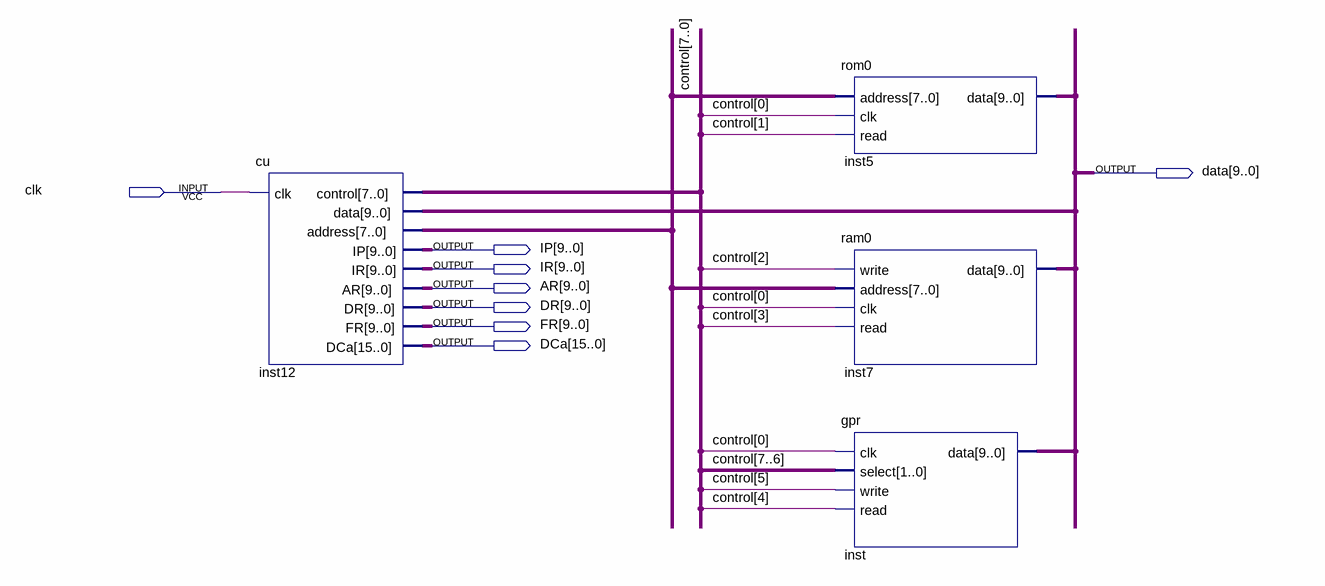
[diagram p0: schematic sheet]
// Quartus schematic Lab4.bdf as structural Verilog: 4 symbols, 8 pins
module Lab4 (
  input  clk,
  output [9:0] data,
  output [9:0] IP,
  output [9:0] IR,
  output [9:0] AR,
  output [9:0] DR,
  output [9:0] FR,
  output [15:0] DCa
);

  wire [7:0] control, inst12_address;

  cu inst12 (
    .clk(clk), .control(control), .address(inst12_address), .IP(IP), .IR(IR), .AR(AR), .DR(DR), .FR(FR),
    .DCa(DCa), .data(data));
  rom0 inst5 (.address(inst12_address), .clk(control[0]), .read(control[1]), .data(data));
  ram0 inst7 (.write(control[2]), .address(inst12_address), .clk(control[0]), .read(control[3]), .data(data));
  gpr inst (.clk(control[0]), .select(control[7:6]), .write(control[5]), .read(control[4]), .data(data));
endmodule
